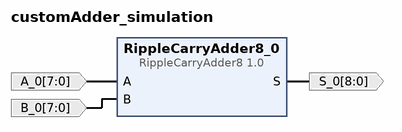
[diagram p0: block diagram of the top level]
# Vivado block design customAdder_simulation, xc7a35tcpg236-2L, Vivado 2023.1
create_bd_design customAdder_simulation

create_bd_port -dir I -from 7 -to 0 -type data A_0
create_bd_port -dir I -from 7 -to 0 -type data B_0
create_bd_port -dir O -from 8 -to 0 -type data S_0

create_bd_cell -type ip -vlnv xilinx.com:user:RippleCarryAdder8:1.0 RippleCarryAdder8_0

# ---- connections ----

connect_bd_net -net A_0_1 [get_bd_ports A_0] [get_bd_pins RippleCarryAdder8_0/A]
connect_bd_net -net B_0_1 [get_bd_ports B_0] [get_bd_pins RippleCarryAdder8_0/B]
connect_bd_net [get_bd_pins RippleCarryAdder8_0/S] [get_bd_ports S_0]

validate_bd_design
save_bd_design
